# Altium schematic sheet flash.SchDoc
size A4; SheetNumber: 5; SheetTotal: 7
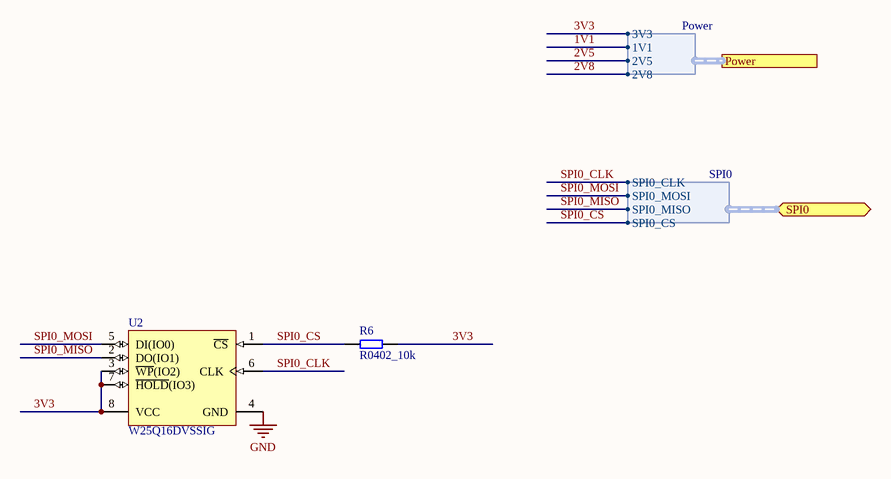
[diagram p0: flash.SchDoc]

## Parts
R6  R0402_10k  [R0402]
U2  W25Q16DVSSIG  [WINB-W25Q16DVSSIG-8_M]

## Ports
Power (harness Power), SPI0 (bidir, harness SPI0)

## Harnesses
SPI0: SPI0_CLK, SPI0_MOSI, SPI0_MISO, SPI0_CS
Power: 3V3, 1V1, 2V5, 2V8

## Nets
GND: U2.4(GND)
1V1: port Power.1V1
2V5: port Power.2V5
2V8: port Power.2V8
3V3: R6.2 U2.3(~{WP}(IO2)) U2.7(~{HOLD}(IO3)) U2.8(VCC) ; port Power.3V3
SPI0_CLK: U2.6(CLK) ; port SPI0.SPI0_CLK
SPI0_CS: R6.1 U2.1(~{CS}) ; port SPI0.SPI0_CS
SPI0_MISO: U2.2(DO(IO1)) ; port SPI0.SPI0_MISO
SPI0_MOSI: U2.5(DI(IO0)) ; port SPI0.SPI0_MOSI

## Library data of the parts
R6 = CMP-004-0443-1: Manufacturer 1: Vishay; Manufacturer Part Number 1: CRCW040210K0FKED; Power Rating: 62,5mW; Value: 10k; Tolerance: 1%; Part Number: R0402_10k; Component Type: Standard; Pin Count: 2
U2 = CMP-2000-05434-1: IC FLASH 16MBIT 104MHZ 8SOIC; Manufacturer: Winbond; Interface Type: Serial(SPI); Rad Hardened: No; Programmable: Yes; Supply Current: 18mA; Number of Words: 2M; Density: 16777216Bit; Word Size: 8b; Sync/Async: Synchronous; Cell Type: NOR; Operating Supply Voltage (Min): 2.7V; Boot Type: Bottom/Top; Address Bus: 24b; Program/Erase Volt (Typ): 2.7to3.6V; Access Time (Max): 7ns; Operating Supply Voltage (Max): 3.6V; Operating Supply Voltage (Typ): 3/3.3V; Mounting: SurfaceMount; Datasheet Version: Rev. D, 10/2012; Manufacturer URL: http://www.winbond.com/hq/index.html?__locale=en; Operating Temperature (Min): -40C; Operating Temperature (Max): 85C; Pin Count: 8; Package Type: SOICW; Datasheet URL: https://ciiva.com/datasheet-click-14728450?src=ciiva&sig=bd4f4644; Operating Temp Range: -40Cto85C; Operating Temperature Classification: Industrial